# Altium project power.PrjPcb
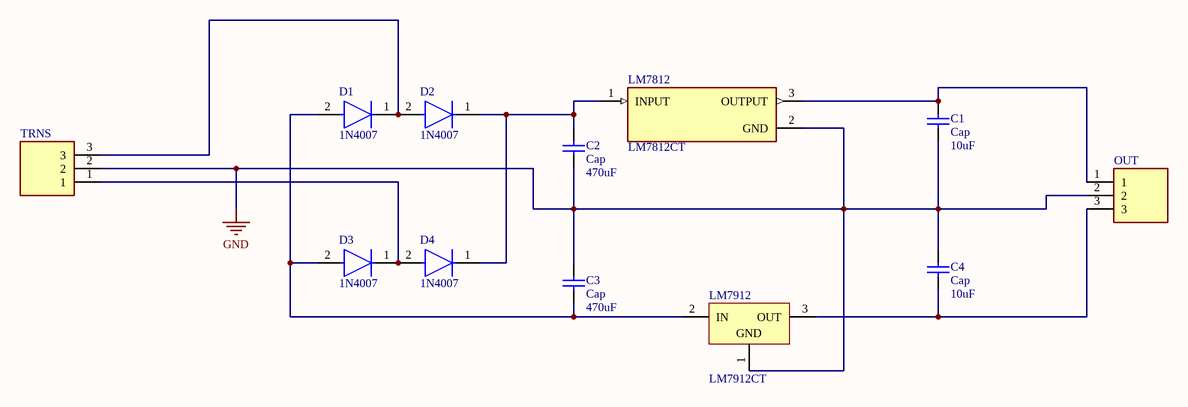
[diagram p0: schemetic.SchDoc]
1 sheet, 12 parts. Net scope: global (net labels, ports and power ports of the same name join across sheets).
Board file: PCB1.PcbDoc

## Sheet schemetic.SchDoc
size A; SheetNumber: 1; SheetTotal: 1

### Parts
C1  Cap  value 10uF  [RAD-0.3]
C2  Cap  value 470uF  [RAD-0.3]
C3  Cap  value 470uF  [RAD-0.3]
C4  Cap  value 10uF  [RAD-0.3]
D1  1N4007  [FP-017AG-MFG]
D2  1N4007  [FP-017AG-MFG]
D3  1N4007  [FP-017AG-MFG]
D4  1N4007  [FP-017AG-MFG]
LM7812  LM7812CT  [FP-TO220B03-MFG]
LM7912  LM7912CT  [NDE0003A]
OUT  (no value)  [CUI_TBP01R2-508-03BE]
TRNS  (no value)  [CUI_TBP01R2-508-03BE]

### Nets
GND: C1.1 C2.1 C3.2 C4.2 LM7812.2(GND) LM7912.1(GND) OUT.2 TRNS.2
NetC1_2: C1.2 LM7812.3(OUTPUT) OUT.1
NetC2_2: C2.2 D2.1(C) D4.1(C) LM7812.1(INPUT)
NetC3_1: C3.1 D1.2(A) D3.2(A) LM7912.2(IN)
NetC4_1: C4.1 LM7912.3(OUT) OUT.3
NetD1_1: D1.1(C) D2.2(A) TRNS.3
NetD3_1: D3.1(C) D4.2(A) TRNS.1

### Library data of the parts
C1-C4 = Cap: Capacitor; Published: 8-Jun-2000; LatestRevisionDate: 17-Jul-2002; LatestRevisionNote: Re-released for DXP Platform.; PackageReference: RAD-0.3; Publisher: Altium Limited; PackageDescription: Radial Cap, Thru-Hole; 2 Leads; 0.3 in Pin Spacing
D1-D4 = CMP-07163-000046-1: DIODE GEN PURP 100V 200MA DO35; Forward Voltage: 1V; Max Power Dissipation: 500mW; Max Reverse Current: 5uA; Forward Current: 300mA; Current: 4A; Reverse Recovery Time: 4ns; Element Configuration: Single; Outside Diameter: 1.85mm; Capacitance: 4pF; Polarity: Standard; Max Forward Surge Current (Ifsm): 1A; Reverse Voltage: 100V; Output Current: 200mA; Average Rectified Current: 200mA; Diameter: 1.91mm; Max Repetitive Reverse Voltage (Vrrm): 100V; Current Rating: 200mA; Case/Package: DO-35; Lead Free: Lead Free; Number of Pins: 2; Recovery Time: 4ns; Packaging: Bulk; Contact Plating: Tin; Voltage: 100V; Mount: Through Hole; Max Surge Current: 4A; Package Quantity: 2000; Width: 1.91mm; Max Reverse Voltage (DC): 100V; Length: 4.56mm; Radiation Hardening: No; Power Dissipation: 500mW; Voltage Rating (DC): 100V; Peak Non-Repetitive Surge Current: 4A; REACH SVHC: No SVHC; Height: 4.56mm; Max Operating Temperature: 175°C; Series: -; Weight: 0.01lb; Min Operating Temperature: -65°C
LM7812 = CMP-07128-000015-1: IC REG LINEAR 12V 1A TO220-3; Obsolete Part: true; Manufacturer: ON Semiconductor; Nominal Supply Current: 5.1mA; Output Type: Fixed; Dropout Voltage: 2V; Max Supply Voltage: 35V; Accuracy Percentage: 4%; Standoff Height: 2.7mm; Number Of Outputs: 1; Octopart: https://octopart.com/lm7812ct-on+semiconductor-14383031; Output Current: 1A; ComponentLink2Description: Datasheet; Device Class L1: Integrated Circuits (ICs); Device Class L2: Power Management ICs; Temperature Range Low: -40°C; Category: IC; Package: TO220B03; Device Class L3: Voltage Regulators - Linear; RoHS: TRUE; Digikey Description: IC REG LINEAR 12V 1A TO220-3; Ipc Land Pattern Name: TO-220; Output Voltage: 12V; Temperature: -40°C to +125°C; Automotive: No; Temperature Range High: +125°C; ComponentLink2URL: https://www.mouser.in/datasheet/2/308/LM7812-1125088.pdf; Manufacturer Part Number: LM7812CT; Height: 20.4mm; Lead Free: Yes
LM7912 = CMP-0062-02472-3: 3-Terminal Negative Regulator, 3-pin TO-220; Manufacturer: Texas Instruments; CompType: LDO IC; PowerWise: N; PackageTopMarking: NSUZXYTTE#*LM7912CT; PinCount: 3; RoHS: N; PackageDescription: TO-220, Molded, 3 Lead, Straight; ComponentLink1URL: http://www.ti.com/general/docs/lit/getliterature.tsp?genericPartNumber=LM7912&fileType=pdf; PackageReference: NDE0003A; ComponentLink1Description: Datasheet URL
OUT TRNS = TBP01R2-508-03BE: MF: {'manufacturer': u'CUI'}; Availability: Unavailable; Price: None; Value: *; MP: TBP01R2-508-03BE; Package: None